# Altium schematic sheet mySensor.SchDoc: STM32 Weather Station
size A4; ApprovedBy: medzie; CheckedBy: medzie; Author: medzie; DrawnBy: medzie; DocumentNumber: REV-01; Revision: 1.0; SheetNumber: 1; SheetTotal: 1
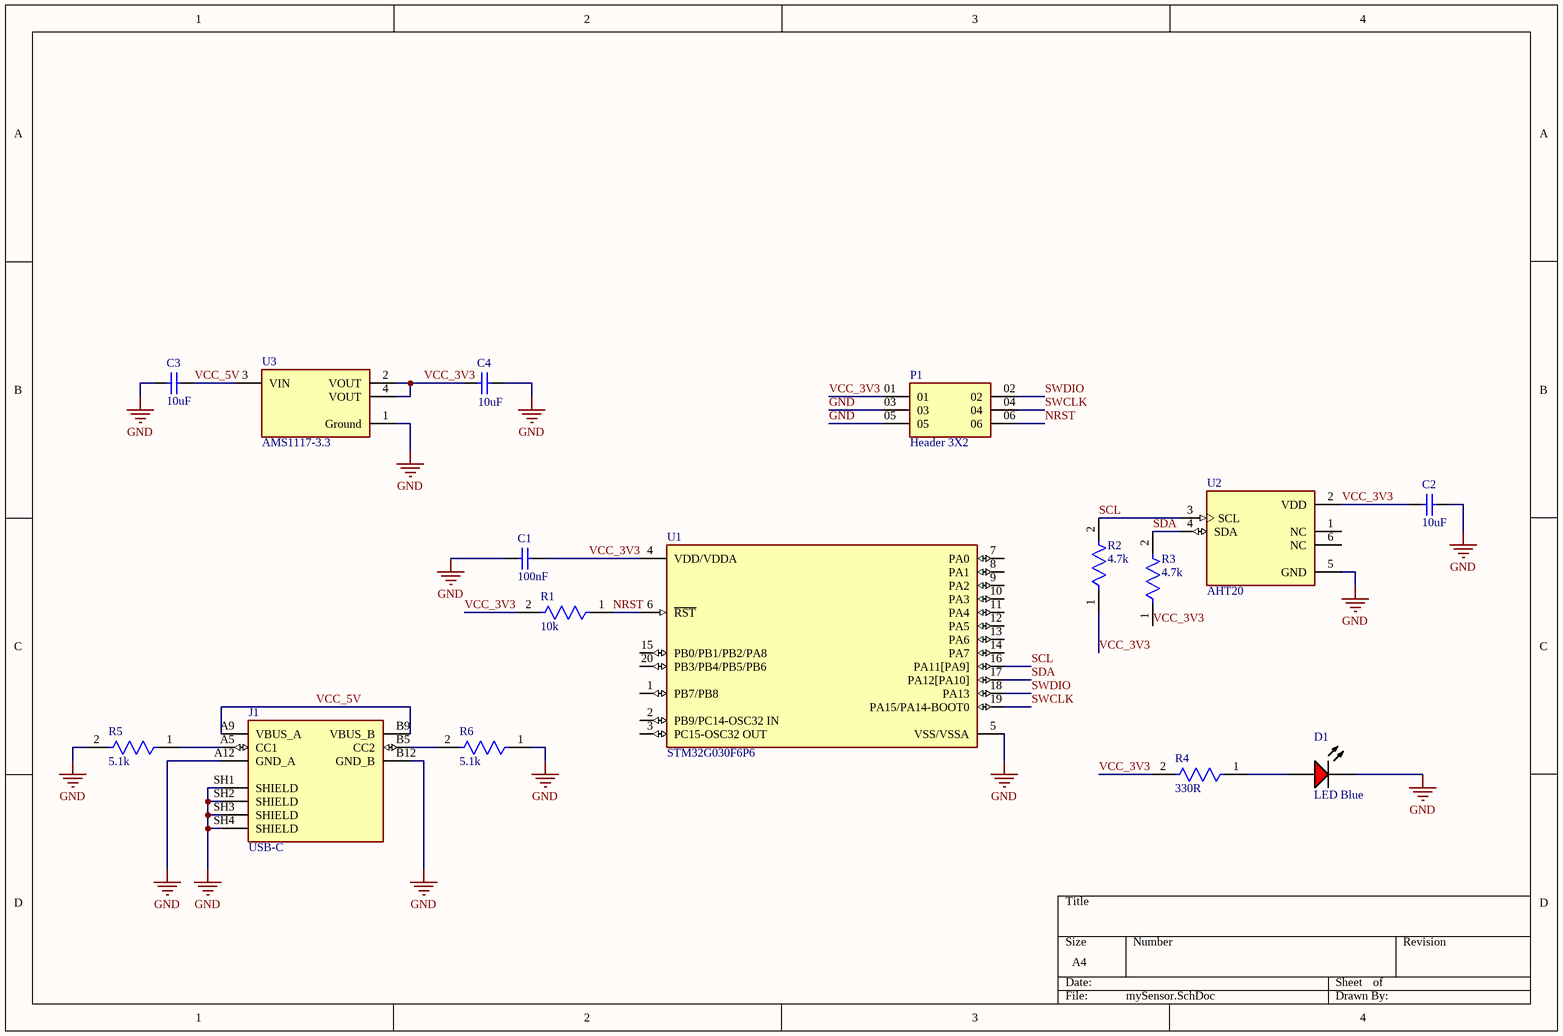
[diagram p0: mySensor.SchDoc]

## Parts
C1  100nF  [CAPC1206(3216)190_L]
C2  10uF  [CAPC1206(3216)190_L]
C3  10uF  [CAPC1206(3216)190_L]
C4  10uF  [CAPC1206(3216)190_L]
D1  LED Blue  [LUMX-SML-LX1206IC_V]
J1  USB-C  [AMPHENOL_10164359-00011LF]
P1  Header 3X2  [SAMTEC_TSM-103-02-T-DV-LC]
R1  10k  [FP-CRGCQ1206-IPC_A]
R2  4.7k  [FP-CRGCQ1206-IPC_A]
R3  4.7k  [FP-CRGCQ1206-IPC_A]
R4  330R  [FP-CRGCQ1206-IPC_A]
R5  5.1k  [FP-CRGCQ1206-IPC_A]
R6  5.1k  [FP-CRGCQ1206-IPC_A]
U1  STM32G030F6P6  [FP-TSSOP20-YA-MFG]
U2  AHT20  [PSON100P300X300X110-6N]
U3  AMS1117-3.3  [FP-AMS1117-IPC_C]

## Nets
GND: C1.1 C2.2 C3.1 C4.2 D1.2(K) J1.A12(GND_A) J1.B12(GND_B) J1.SH1(SHIELD) J1.SH2(SHIELD) J1.SH3(SHIELD) J1.SH4(SHIELD) P1.03 P1.05 R5.2 R6.1 U1.5(VSS/VSSA) U2.5(GND) U3.1(Ground)
NRST: P1.06 R1.1 U1.6(~{RST})
SCL: R2.2 U1.16(PA11[PA9]) U2.3(SCL)
SDA: R3.2 U1.17(PA12[PA10]) U2.4(SDA)
SWCLK: P1.04 U1.19(PA15/PA14-BOOT0)
SWDIO: P1.02 U1.18(PA13)
VCC_3V3: C1.2 C2.1 C4.1 P1.01 R1.2 R2.1 R3.1 R4.2 U1.4(VDD/VDDA) U2.2(VDD) U3.2(VOUT) U3.4(VOUT)
VCC_5V: C3.2 J1.A9(VBUS_A) J1.B9(VBUS_B) U3.3(VIN)
NetD1_1: D1.1(A) R4.1
NetJ1_A5: J1.A5(CC1) R5.1
NetJ1_B5: J1.B5(CC2) R6.2

Not connected (* = marked no-connect by the designer): U1 1(PB7/PB8) 2(PB9/PC14-OSC32_IN) 3(PC15-OSC32_OUT) 7(PA0) 8(PA1) 9(PA2) 10(PA3) 11(PA4) 12(PA5) 13(PA6) 14(PA7) 15(PB0/PB1/PB2/PA8) 20(PB3/PB4/PB5/PB6); U2 1(NC) 6(NC)

## Library data of the parts
C1 = CMP-1037-04963-1: CAP 100nF; Case-Metric: 3216; Tolerance: Â±20%; Rated Voltage: 6.3 V; Value: 10uF; Case-EIA: 1206; Max Thickness: 1.9 mm; Technology: SMT
C2-C4 = CMP-1037-04963-1: CAP 10uF 6.3V ±20% 1206 (3216 Metric) Thickness 1.9mm SMD; Case-Metric: 3216; Tolerance: Â±20%; Case-EIA: 1206; Max Thickness: 1.9 mm; Rated Voltage: 6.3 V; Technology: SMT; Value: 10uF
D1 = CMP-2000-07123-1: LED Red, 65 mW, -40 to 85 degC, 2-Pin SMD, RoHS, Tape and Reel; Manufacturer: Lumex; Part No: SML-LX1206IC-TR; LED Material: GaAsP; Peak Wavelength: 635nm; Number of LEDs: 1; Viewing Angle: 160; Reverse Voltage: 5(Min)V; Lens Appearance: ColorlessNonDiffused; Intensity: 6mcd; Type: Uni-Color; Pin_Count: 2; Lens Dimensions: 2x1.6x0.5mm; Mounting: SurfaceMount; ECCN: EAR99; RoHS: Unknown; Package Description: 2-Pin Surface Mount Device, Body 3.2 x 1.5 mm; Mounting Technology: SurfaceMount; Dominant Wavelength: N/A; Supplier_Package: SMD; Supplier Standard Pack: 3,000; Color: Red; Dimension: 3.2x1.6x1.1mm; HTS: 8541402000; Family: SML-LX1206IC; Supplier: Lumex; Datasheet URL: http://www.lumex.com/content/files/ProductAttachment/SML-LX1206IC-TR.pdf; Package Reference: SML-LX1206IC; Manufacturer URL: http://www.lumexinstruments.com/; Operating Temperature: -25to85C; Packaging: TapeandReel; Datasheet Version: Rev. J, 08/2012
J1 = 10164359-00011LF: USB Type C Receptacle SMT Single Row 6Pin; MF: Amphenol; MP: 1016435900011LF; SnapEDA_Link: https://www.snapeda.com/parts/1016435900011LF/Amphenol/view-part/?ref=snap; Package: None; Value: *; Check_prices: https://www.snapeda.com/parts/1016435900011LF/Amphenol/view-part/?ref=eda
P1 = TSM-103-02-T-DV-LC: Conn Unshrouded Header HDR 6 POS 2.54mm Solder ST SMD Tube; MF: Samtec; SnapEDA_Link: https://www.snapeda.com/parts/TSM-103-02-T-DV-LC/Samtec/view-part/?ref=snap; Package: None; Value: *; MP: TSM-103-02-T-DV-LC; Check_prices: https://www.snapeda.com/parts/TSM-103-02-T-DV-LC/Samtec/view-part/?ref=eda
R1 = CMP-03211-006585-1: CRGCQ 1206 10k 5%; Manufacturer: TE Connectivity; Manufacturer Part Number: CRGCQ1206J4K7; Automotive Grade: Grade 838; Temperature Coefficient: ±100ppm/°C; Power Rating: 0.25W; Value: 4.7KΩ; Voltage Rating: 200V; Tolerance: 0.05; Temperature Range Low: -55°C; Device Class L2: Resistors; ComponentLink2Description: Datasheet; Temperature Range High: +155°C; ComponentLink2URL: https://www.te.com/commerce/DocumentDelivery/DDEController?Action=showdoc&DocId=Data+Sheet%7F1773204-3%7F1%7Fpdf%7FEnglish%7FENG_DS_1773204-3_1.pdf%7F4-2176347-847; Height: 0.65mm; Digikey Description: CRGCQ 1206 4K7 5%; RoHS: TRUE; Octopart: https://octopart.com/crgcq1206j4k7-te+connectivity-91018336; Package: CRGCQ1206; Device Class L1: Passive Components; Automotive: Yes; Composition: Thick Film; Lead Free: Yes; Temperature: -55°C to +155°C; Resistance: 4.7KΩ; Ipc Land Pattern Name: RESC310155X55; Ambient Temperature Range High: +70°C; Category: Res; Series: CRGCQ; Device Class L3: Chip SMD Resistors
R2 R3 = CMP-03211-006585-1: CRGCQ 1206 4K7 5%; Manufacturer: TE Connectivity; Manufacturer Part Number: CRGCQ1206J4K7; Automotive Grade: Grade 838; Temperature Coefficient: ±100ppm/°C; Power Rating: 0.25W; Value: 4.7KΩ; Voltage Rating: 200V; Tolerance: 0.05; Temperature Range Low: -55°C; Device Class L2: Resistors; ComponentLink2Description: Datasheet; Temperature Range High: +155°C; ComponentLink2URL: https://www.te.com/commerce/DocumentDelivery/DDEController?Action=showdoc&DocId=Data+Sheet%7F1773204-3%7F1%7Fpdf%7FEnglish%7FENG_DS_1773204-3_1.pdf%7F4-2176347-847; Height: 0.65mm; Digikey Description: CRGCQ 1206 4K7 5%; RoHS: TRUE; Octopart: https://octopart.com/crgcq1206j4k7-te+connectivity-91018336; Package: CRGCQ1206; Device Class L1: Passive Components; Automotive: Yes; Composition: Thick Film; Lead Free: Yes; Temperature: -55°C to +155°C; Resistance: 4.7KΩ; Ipc Land Pattern Name: RESC310155X55; Ambient Temperature Range High: +70°C; Category: Res; Series: CRGCQ; Device Class L3: Chip SMD Resistors
R4 = CMP-03211-006585-1: CRGCQ 1206 330R 5%; Manufacturer: TE Connectivity; Manufacturer Part Number: CRGCQ1206J4K7; Automotive Grade: Grade 838; Temperature Coefficient: ±100ppm/°C; Power Rating: 0.25W; Value: 4.7KΩ; Voltage Rating: 200V; Tolerance: 0.05; Temperature Range Low: -55°C; Device Class L2: Resistors; ComponentLink2Description: Datasheet; Temperature Range High: +155°C; ComponentLink2URL: https://www.te.com/commerce/DocumentDelivery/DDEController?Action=showdoc&DocId=Data+Sheet%7F1773204-3%7F1%7Fpdf%7FEnglish%7FENG_DS_1773204-3_1.pdf%7F4-2176347-847; Height: 0.65mm; Digikey Description: CRGCQ 1206 4K7 5%; RoHS: TRUE; Octopart: https://octopart.com/crgcq1206j4k7-te+connectivity-91018336; Package: CRGCQ1206; Device Class L1: Passive Components; Automotive: Yes; Composition: Thick Film; Lead Free: Yes; Temperature: -55°C to +155°C; Resistance: 4.7KΩ; Ipc Land Pattern Name: RESC310155X55; Ambient Temperature Range High: +70°C; Category: Res; Series: CRGCQ; Device Class L3: Chip SMD Resistors
R5 R6 = CMP-03211-006585-1: CRGCQ 1206 5K1 5%; Manufacturer: TE Connectivity; Manufacturer Part Number: CRGCQ1206J4K7; Automotive Grade: Grade 838; Temperature Coefficient: ±100ppm/°C; Power Rating: 0.25W; Value: 4.7KΩ; Voltage Rating: 200V; Tolerance: 0.05; Temperature Range Low: -55°C; Device Class L2: Resistors; ComponentLink2Description: Datasheet; Temperature Range High: +155°C; ComponentLink2URL: https://www.te.com/commerce/DocumentDelivery/DDEController?Action=showdoc&DocId=Data+Sheet%7F1773204-3%7F1%7Fpdf%7FEnglish%7FENG_DS_1773204-3_1.pdf%7F4-2176347-847; Height: 0.65mm; Digikey Description: CRGCQ 1206 4K7 5%; RoHS: TRUE; Octopart: https://octopart.com/crgcq1206j4k7-te+connectivity-91018336; Package: CRGCQ1206; Device Class L1: Passive Components; Automotive: Yes; Composition: Thick Film; Lead Free: Yes; Temperature: -55°C to +155°C; Resistance: 4.7KΩ; Ipc Land Pattern Name: RESC310155X55; Ambient Temperature Range High: +70°C; Category: Res; Series: CRGCQ; Device Class L3: Chip SMD Resistors
U1 = CMP-12105-000034-1: ARM MICROCONTROLLERS - MCU; Manufacturer: STMicroelectronics; Max Supply Voltage: 3.6V; Interface: I2C,SPI,USART,LIN,IrDA,I2S,SMBus; Memory Size: 32KBytes; Number Of I/Os: 17; Number Of Timers/Counters: 6; Core Architecture: ARM Cortex-M0+; Number Of Pwm Channels: 11; Standoff Height: 0.05mm; Number Of A/D Converters: 1; Number Of I2C Channels: 2; Data Bus Width: 32bits; Ram Size: 8KBytes; Max Junction Temp: +105°C; Number Of Spi Channels: 3; Min Supply Voltage: 2V; Number Of Adc Channels: 16; Memory Type: FLASH; Frequency: 64MHz; Ambient Temperature Range Low: -40°C; ComponentLink2URL: https://www.st.com/resource/en/datasheet/stm32g030f6.pdf; Temperature Range Low: -40°C; Automotive: No; Device Class L1: Integrated Circuits (ICs); Category: IC; Temperature Range High: +85°C; ComponentLink2Description: Datasheet; Device Class L2: Embedded Processors and Controllers; Manufacturer Part Number: STM32G030F6P6; Height: 1.2mm; Ambient Temperature Range High: +85°C; Octopart: https://octopart.com/stm32g030f6p6-stmicroelectronics-103773023; Package: TSSOP20-YA; Temperature: -40°C to +85°C; Lead Free: Yes; Device Class L3: Microcontrollers; Number Of Uart Channels: 2; RoHS: TRUE; Number Of Cores: 1; Digikey Description: ARM MICROCONTROLLERS - MCU
U2 = AHT20: Temperature and Humidity sensor; MF: Asair; SnapEDA_Link: https://www.snapeda.com/parts/AHT20/Asair/view-part/?ref=snap; Package: Package; Value: *; MP: AHT20; Check_prices: https://www.snapeda.com/parts/AHT20/Asair/view-part/?ref=eda
U3 = CMP-209535-000001-1: LDO Voltage Regulators 1A, 3.3V; Manufacturer: Advanced Monolithic Systems; Dropout Voltage: 1.1V; Output Type: Fixed; Nominal Supply Current: 5mA; Max Power Dissipation: 1.2W; Max Supply Voltage: 15V; Number Of Outputs: 1; Standoff Height: 0.64mm; Max Junction Temp: +125°C; Height: 1.8mm; Package: AMS1117; Device Class L2: Power Management ICs; ComponentLink2Description: Datasheet; ComponentLink2URL: http://www.advanced-monolithic.com/pdf/ds1117.pdf; Category: IC; RoHS: TRUE; Automotive: No; Device Class L1: Integrated Circuits (ICs); Output Current: 1A; Device Class L3: Voltage Regulators - Linear; Temperature: -40°C to +125°C; Output Voltage: 3.3V; Manufacturer Part Number: AMS1117-3.3; Temperature Range Low: -40°C; Octopart: https://octopart.com/ams1117-3.3-advanced+monolithic+systems-25899300; Lead Free: Yes; Ipc Land Pattern Name: SOT229P700X180-4; Temperature Range High: +125°C